# Altium project Quadruped_Wiring.PrjPcb
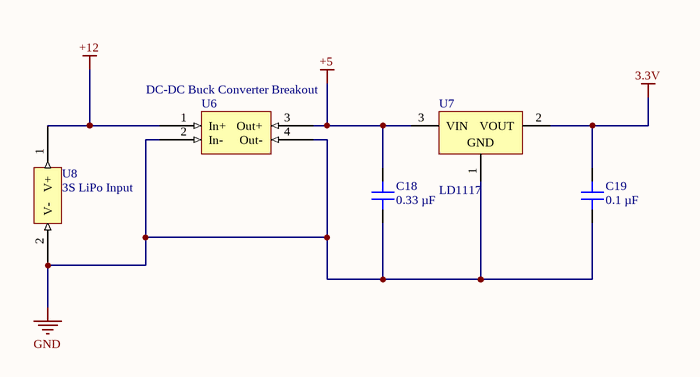
[diagram p0: Power_Circuit.SchDoc]
2 sheets, 8 parts. Net scope: flat (ports and power ports of the same name join across sheets).
Board file: Quadruped_ShieldPCB.PcbDoc
Sheets:
  Power_Circuit.SchDoc
  LCD_Schem.SchDoc

## Sheet Power_Circuit.SchDoc
size A; SheetNumber: 3; SheetTotal: 6

### Parts
C18  0.33 µF  [CAP 1210_3225 - 1MM]
C19  0.1 µF  [CAP 1210_3225 - 1MM]
U6  DC-DC Buck Converter Breakout  [DC-DC Buck Converter Breakout-Footprint-1]
U7  LD1117  [PCB - LEADED - TO - TO-220]
U8  3S LiPo Input  [3S LiPo Input-Footprint-2]

### Nets
3.3V: C19.2 U7.2(VOUT)
+5: C18.2 U6.3(Out+) U7.3(VIN)
+12: U6.1(In+) U8.1(V+)
GND: C18.1 C19.1 U6.2(In-) U6.4(Out-) U7.1(GND) U8.2(V-)

### Library data of the parts
C18 = C1210C334J3RAC7800: CAP CER 0.33UF 25V X7R 1210; manufacturer: KEMET; Tolerance: ±5%; Part Number: C1210C334J3RAC7800; Value: 0.33 µF; Applications: Bypass, Decoupling; Capacitance: 0.33 µF; componentlink1description: Datasheet; componentlink1url: https://api.kemet.com/component-edge/download/datasheet/C1210C334J3RACTU.pdf; componentlink2description: DigiKey Link; componentlink2url: https://www.digikey.com/en/products/detail/kemet/C1210C334J3RAC7800/2216802; Device Package: 1210 (3225 Metric); lastupdated: 9/19/2022 1:23:31 PM; Lifecycle Status: Active; Minimum Order: 1; Mounting Type: Surface Mount, MLCC; Operating Temperature: -55°C ~ 125°C; Package / Case: 1210 (3225 Metric); packaging: TapeAndReel; partid: 25129; Part Status: Active; price: 0.39; series: SMD Comm X7R; Size / Dimension: 0.126" L x 0.098" W (3.20mm x 2.50mm); Supplier 1: DigiKey; Supplier Part Number 1: 399-17497-1-ND; Temperature Coefficient: X7R; Thickness (Max): 0.041" (1.05mm); Voltage - Rated: 25V
C19 = C1210C104J5GACAUTO: CAP CER 0.1UF 50V C0G/NP0 1210; manufacturer: KEMET; Temperature Coefficient: C0G, NP0; Tolerance: ±5%; Part Number: C1210C104J5GACAUTO; Value: 0.1 µF; Applications: Automotive; Capacitance: 0.1 µF; componentlink1description: Datasheet; componentlink1url: https://api.kemet.com/component-edge/download/datasheet/C1210C104J5GACAUTO.pdf; componentlink2description: DigiKey Link; componentlink2url: https://www.digikey.com/en/products/detail/kemet/C1210C104J5GACAUTO/7516038; Device Package: 1210 (3225 Metric); Features: Low ESL; lastupdated: 9/19/2022 1:23:33 PM; Lifecycle Status: Active; Minimum Order: 1; Mounting Type: Surface Mount, MLCC; Operating Temperature: -55°C ~ 125°C; Package / Case: 1210 (3225 Metric); packaging: TapeAndReel; partid: 43680; Part Status: Active; price: 0.54; Ratings: AEC-Q200; series: SMD Auto C0G; Size / Dimension: 0.126" L x 0.098" W (3.20mm x 2.50mm); Supplier 1: DigiKey; Supplier Part Number 1: 399-15804-1-ND; Thickness (Max): 0.055" (1.40mm); Voltage - Rated: 50V
U6 = CMP-00001-3
U7 = 776: Linear Voltage Regulator IC  1 Output  1A TO-220AB; Rowan Part Number: 776; Manufacturer: STMicroelectronics; Manufacturer part number: LD1117AV33; Name: LD1117 - 3.3V Linear Regulator; Voltage - Output (Min or Fixed): 3.3V; Output Type: Fixed; Voltage - Input (Max): 15V; Dropout Voltage: 1.3V @ 1A; Output Configuration: Positive; Supplier 1: Digi-Key; Supplier Part Number 1: 497-1485-5-ND; Category: Linear Regulators; Datasheet: http://www.st.com/content/ccc/resource/technical/document/datasheet/a5/c3/3f/c9/2b/15/40/49/CD00002116.pdf/files/CD00002116.pdf/jcr:content/translations/en.CD00002116.pdf; Status: Active; Output Current: 1A; Voltage - Output (Max): -; Package: TO-220-3; Packaging: Tube; Type: Linear Regulator; Base Part Number: LD1117
U8 = CMP-00000-1

## Sheet LCD_Schem.SchDoc
size A; SheetNumber: 6; SheetTotal: 6
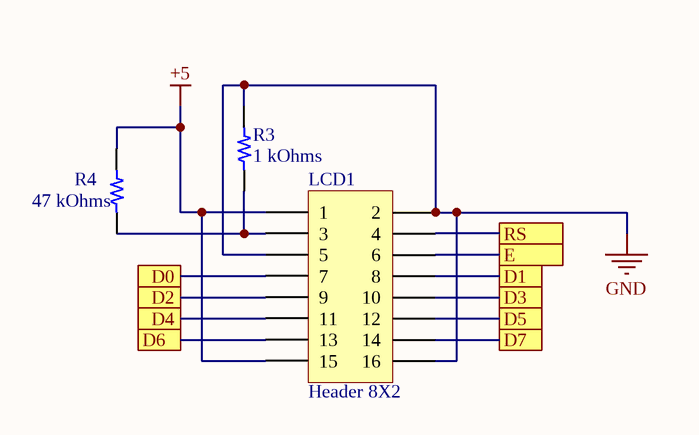
[diagram p1: LCD_Schem.SchDoc]

### Parts
LCD1  Header 8X2  [HDR2X8]
R3  1 kOhms  [RES 1210_3225]
R4  47 kOhms  [RES 1210_3225]

### Ports
D0, D1, D2, D3, D4, D5, D6, D7, E, RS

### Nets
+5: LCD1.1 LCD1.15 R4.2
GND: LCD1.2 LCD1.5 LCD1.16 R3.2
NetLCD1_3: LCD1.3 R3.1 R4.1
NetLCD1_4: LCD1.4 ; port RS
NetLCD1_6: LCD1.6 ; port E
NetLCD1_7: LCD1.7 ; port D0
NetLCD1_8: LCD1.8 ; port D1
NetLCD1_9: LCD1.9 ; port D2
NetLCD1_10: LCD1.10 ; port D3
NetLCD1_11: LCD1.11 ; port D4
NetLCD1_12: LCD1.12 ; port D5
NetLCD1_13: LCD1.13 ; port D6
NetLCD1_14: LCD1.14 ; port D7

### Library data of the parts
LCD1 = Header 8X2: Header, 8-Pin, Dual row; LatestRevisionDate: 17-Jul-2002; LatestRevisionNote: Re-released for DXP Platform.; Publisher: Altium Limited
R3 = ESR25JZPJ102: RES SMD 1K OHM 5% 2/3W 1210; Manufacturer: Rohm Semiconductor; Power (Watts): 0.667W, 2/3W; Temperature Coefficient: ±200ppm/°C; Part Number: ESR25JZPJ102; ComponentLink1Description: Datasheet; ComponentLink1URL: https://www.rohm.com/datasheet/ESR01MZPF/esr-e; ComponentLink2Description: DigiKey Link; ComponentLink2URL: https://www.digikey.com/en/products/detail/rohm-semiconductor/ESR25JZPJ102/2288498; Composition: Thick Film; Device Package: 1210 (3225 Metric); Features: Automotive AEC-Q200, Pulse Withstanding; Height - Seated (Max): 0.026" (0.65mm); LastUpdated: 9/19/2022 2:02:25 PM; Lifecycle Status: Active; Minimum Order: 1; Number of Terminations: 2; Operating Temperature: -55°C ~ 155°C; Package / Case: 1210 (3225 Metric); Packaging: TapeAndReel; Part Status: Active; Price: 0.05; Ratings: AEC-Q200; Resistance: 1 kOhms; Series: ESR; Size / Dimension: 0.126" L x 0.098" W (3.20mm x 2.50mm); Supplier 1: DigiKey; Supplier Part Number 1: RHM1.0KAXCT-ND; Supplier Device Package: 1210; Tolerance: ±5%; Value: 1 kOhms
R4 = CRGP1210F47K: RES 47K OHM 1% 3/4W 1210; Manufacturer: TE Connectivity Passive Product; Power (Watts): 0.75W, 3/4W; Temperature Coefficient: ±100ppm/°C; Part Number: CRGP1210F47K; ComponentLink1Description: Datasheet; ComponentLink1URL: https://www.te.com/commerce/DocumentDelivery/DDEController?Action=srchrtrv&DocNm=9-1773463-9&DocType=DS&DocLang=English; ComponentLink2Description: DigiKey Link; ComponentLink2URL: https://www.digikey.com/en/products/detail/te-connectivity-passive-product/CRGP1210F47K/8577221; Composition: Thick Film; Device Package: 1210 (3225 Metric); Features: Pulse Withstanding; Height - Seated (Max): 0.026" (0.65mm); LastUpdated: 9/19/2022 2:02:30 PM; Lifecycle Status: Active; Minimum Order: 1; Number of Terminations: 2; Operating Temperature: -55°C ~ 155°C; Package / Case: 1210 (3225 Metric); Packaging: TapeAndReel; Part Status: Active; Price: 0.04; Resistance: 47 kOhms; Series: CRGP; Size / Dimension: 0.122" L x 0.102" W (3.10mm x 2.60mm); Supplier 1: DigiKey; Supplier Part Number 1: A130619CT-ND; Supplier Device Package: 1210; Tolerance: ±1%; Value: 47 kOhms

## Nets that join several sheets
+5: Power_Circuit (C18.2 U6.3 U7.3), LCD_Schem (LCD1.1 LCD1.15 R4.2)
GND: Power_Circuit (6 pins), LCD_Schem (LCD1.2 LCD1.5 LCD1.16 R3.2)